# Altium schematic sheet lorabreakout.SchDoc
size A3
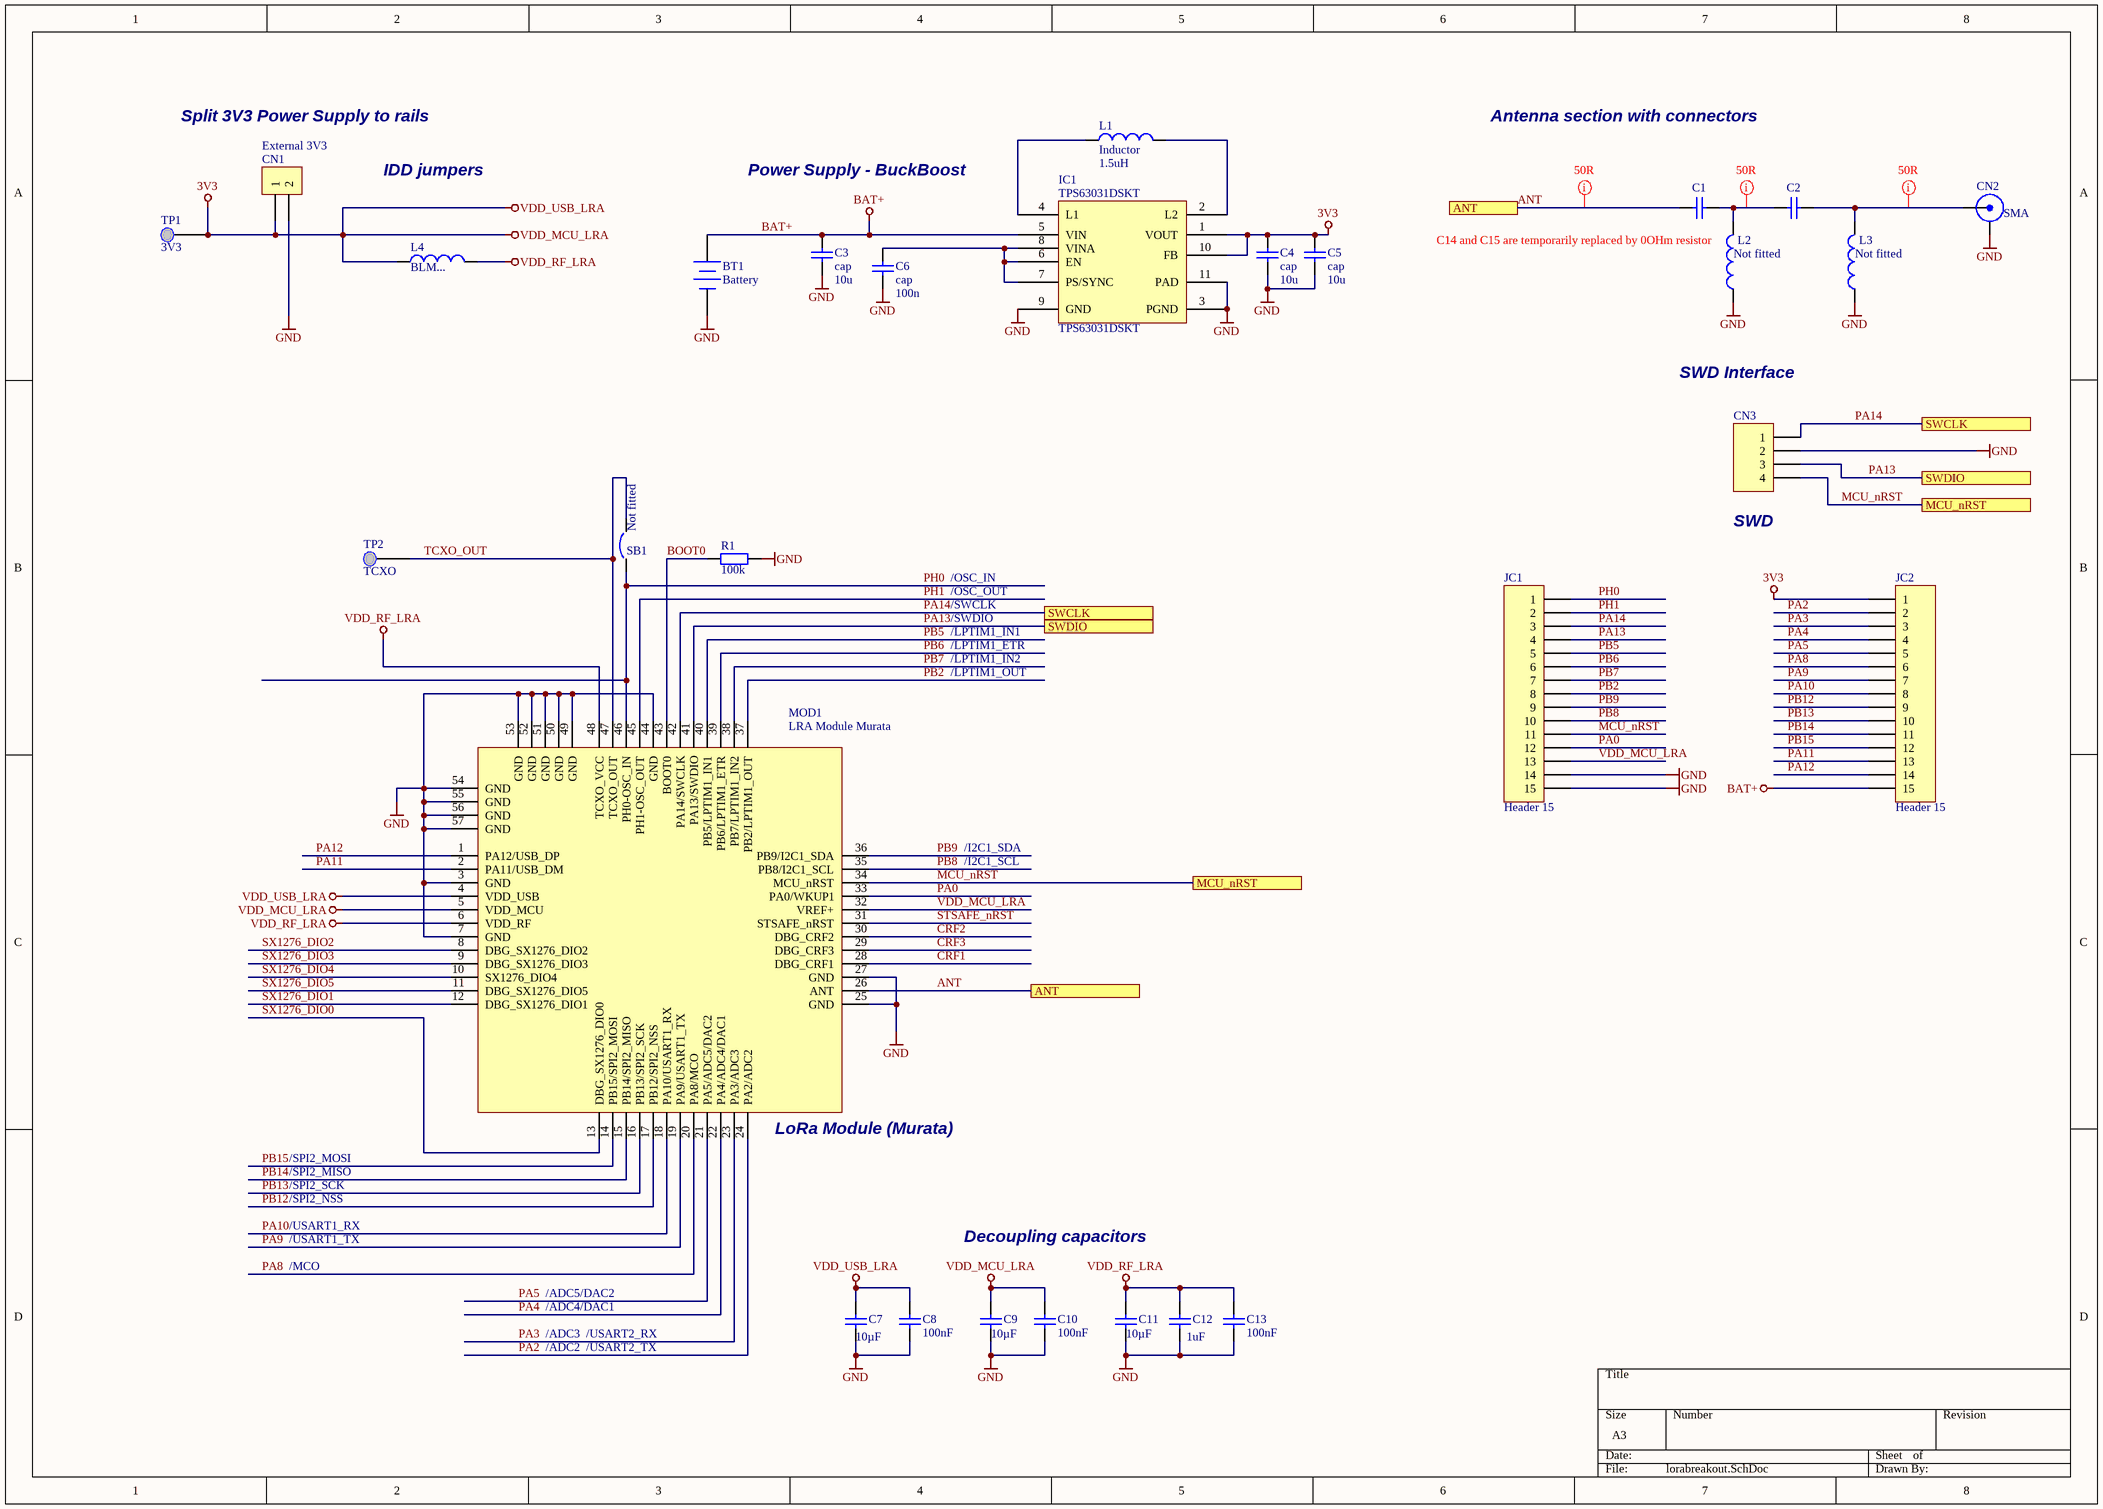
[diagram p0: lorabreakout.SchDoc]

## Parts
BT1  Battery  [SIP2]
C1  (no value)  [0402]
C2  (no value)  [0402]
C3  cap  value 10u  [0603ok]
C4  cap  value 10u  [0603ok]
C5  cap  value 10u  [0603ok]
C6  cap  value 100n  [0603ok]
C7  10µF  [0603C]
C8  100nF  [0603C]
C9  10µF  [0603C]
C10  100nF  [0603C]
C11  10µF  [0603C]
C12  1uF  [0603C]
C13  100nF  [0603C]
CN1  External 3V3  [SIP2]
CN2  SMA  [SMA_COMBO_B]
CN3  Header 4  [SIP4]  (value not drawn)
IC1  TPS63031DSKT  [QFN50P250X250X80_HS-11N]
JC1  Header 15  [HDR1X15]
JC2  Header 15  [HDR1X15]
L1  Inductor  value 1.5uH  [lps3015]
L2  (no value)  [0402]
L3  (no value)  [0402]
L4  BLM...  [0603ok]
MOD1  LRA Module Murata  [Lora Module ES0]
R1  value 100k  [0402]  (hidden comment: Res2)
SB1  Circuit Breaker  [JP2_SMD]  (value not drawn)
TP1  3V3  [SMD-MINITP]
TP2  TCXO  [SMD-MINITP]

## Ports
ANT, MCU_nRST, SWCLK, SWDIO

## Nets
BAT+: BT1.1(+) C3.2 IC1.5(VIN) JC2.15
GND: BT1.2(-) C3.1 C4.1 C5.1 C6.1 C7.2 C8.1 C9.2 C10.1 C11.2 C12.1 C13.1 CN1.2 CN2.2(Y) CN3.2 IC1.3(PGND) IC1.9(GND) IC1.11(PAD) JC1.14 JC1.15 L2.1 L3.1 MOD1.3(GND) MOD1.7(GND) MOD1.25(GND) MOD1.27(GND) MOD1.44(GND) MOD1.49(GND) MOD1.50(GND) MOD1.51(GND) MOD1.52(GND) MOD1.53(GND) MOD1.54(GND) MOD1.55(GND) MOD1.56(GND) MOD1.57(GND) R1.1
VDD_MCU_LRA: C4.2 C5.2 C7.1 C8.2 C9.1 C10.2 CN1.1 IC1.1(VOUT) IC1.10(FB) JC1.13 JC2.1 L4.1 MOD1.4(VDD_USB) MOD1.5(VDD_MCU) MOD1.32(VREF+) TP1.1  [also labelled 3V3, VDD_USB_LRA]
VDD_RF_LRA: C11.1 C12.2 C13.2 L4.2 MOD1.6(VDD_RF) MOD1.48(TCXO_VCC)
ANT: C1.1 MOD1.26(ANT) ; port ANT
BOOT0: MOD1.43(BOOT0) R1.2
CRF1: MOD1.28(DBG_CRF1)
CRF2: MOD1.30(DBG_CRF2)
CRF3: MOD1.29(DBG_CRF3)
MCU_nRST: CN3.4 JC1.11 MOD1.34(MCU_nRST) ; port MCU_nRST
PA0: JC1.12 MOD1.33(PA0/WKUP1)
PA2: JC2.2 MOD1.24(PA2/ADC2)
PA3: JC2.3 MOD1.23(PA3/ADC3)
PA4: JC2.4 MOD1.22(PA4/ADC4/DAC1)
PA5: JC2.5 MOD1.21(PA5/ADC5/DAC2)
PA8: JC2.6 MOD1.20(PA8/MCO)
PA9: JC2.7 MOD1.19(PA9/USART1_TX)
PA10: JC2.8 MOD1.18(PA10/USART1_RX)
PA11: JC2.13 MOD1.2(PA11/USB_DM)
PA12: JC2.14 MOD1.1(PA12/USB_DP)
PA13: CN3.3 JC1.4 MOD1.41(PA13/SWDIO) ; port SWDIO
PA14: CN3.1 JC1.3 MOD1.42(PA14/SWCLK) ; port SWCLK
PB2: JC1.8 MOD1.37(PB2/LPTIM1_OUT)
PB5: JC1.5 MOD1.40(PB5/LPTIM1_IN1)
PB6: JC1.6 MOD1.39(PB6/LPTIM1_ETR)
PB7: JC1.7 MOD1.38(PB7/LPTIM1_IN2)
PB8: JC1.10 MOD1.35(PB8/I2C1_SCL)
PB9: JC1.9 MOD1.36(PB9/I2C1_SDA)
PB12: JC2.9 MOD1.17(PB12/SPI2_NSS)
PB13: JC2.10 MOD1.16(PB13/SPI2_SCK)
PB14: JC2.11 MOD1.15(PB14/SPI2_MISO)
PB15: JC2.12 MOD1.14(PB15/SPI2_MOSI)
PH0: JC1.1 MOD1.46(PH0-OSC_IN) SB1.1
PH1: JC1.2 MOD1.45(PH1-OSC_OUT)
STSAFE_nRST: MOD1.31(STSAFE_nRST)
SX1276_DIO0: MOD1.13(DBG_SX1276_DIO0)
SX1276_DIO1: MOD1.12(DBG_SX1276_DIO1)
SX1276_DIO2: MOD1.8(DBG_SX1276_DIO2)
SX1276_DIO3: MOD1.9(DBG_SX1276_DIO3)
SX1276_DIO4: MOD1.10(SX1276_DIO4)
SX1276_DIO5: MOD1.11(DBG_SX1276_DIO5)
TCXO_OUT: MOD1.47(TCXO_OUT) SB1.2 TP2.1
NetC1_2: C1.2 C2.1 L2.2
NetC2_2: C2.2 CN2.1(X) L3.2
NetC6_2: C6.2 IC1.6(EN) IC1.7(PS/SYNC) IC1.8(VINA)
NetIC1_2: IC1.2(L2) L1.2
NetIC1_4: IC1.4(L1) L1.1

## Layout directives
net class 50R; rule Clearance Constraint [Clearance = 6.2mil]: ANT, NetC1_2, NetC2_2

## Notes on the sheet
- Split 3V3 Power Supply to rails
- IDD jumpers
- Power Supply - BuckBoost
- Antenna section with connectors
- (near L2) C14 and C15 are temporarily replaced by 0OHm resistor
- (near L2) Not fitted
- (near L3) Not fitted
- SWD Interface
- (near SB1) Not fitted
- /OSC_IN
- (near CN3) SWD
- /OSC_OUT
- /SWCLK
- /SWDIO
- /LPTIM1_IN1
- /LPTIM1_ETR
- /LPTIM1_IN2
- /LPTIM1_OUT
- /I2C1_SDA
- /I2C1_SCL
- /SPI2_MOSI
- /SPI2_MISO
- /SPI2_SCK
- (near MOD1) LoRa Module (Murata)
- /SPI2_NSS
- /USART1_RX
- /USART1_TX
- Decoupling capacitors
- /MCO
- /ADC5/DAC2
- /ADC4/DAC1
- /ADC3
- /ADC2
- /USART2_TX
- /USART2_RX

## Library data of the parts
BT1 = Battery: Multicell Battery; Published: 24-Mar-1999; LatestRevisionDate: 17-Jul-2002; LatestRevisionNote: Re-released for DXP Platform.; PackageReference: BAT-2; Publisher: Altium Limited; PackageDescription: Battery; 2 Leads
C1 C2 = CAP SMD 0402 NPO 18PF 16V 5%: 0402; Value: 0E; Fitted: Yes 0Ohm resistor; Manufacturer: *; Manufacturer P/N: *; Order code Farnell: *; Order code RS: *; ECCN_US/UE: *; Order Code Digikey: *; Provided by: *
C3-C6 = cap: Capacitor; Published: 8-Jun-2000; LatestRevisionDate: 17-Jul-2002; LatestRevisionNote: Re-released for DXP Platform.; PackageReference: RAD-0.3; Publisher: Altium Limited; PackageDescription: Radial Cap, Thru-Hole; 2 Leads; 0.3 in Pin Spacing
C7 C9 C11 = CAP_C0805C106K8RACTU: Capacitor SMD 0805 10000000pF X7R 10V +/-10%; Manufacturer: Kemet; Order code RS: ...; Tolerance: 10%; Fitted: Yes; Manufacturer P/N: C0805C106K8RACTU; Order code Farnell: 2118132; Value: 10µF; Rated voltage: 10V; Technology: X7R; Temperature Max: +125°C; Temperature Min: -55°C; Order code Digikey: 399-7411-1-ND
C8 C10 = CAP: Capacitor 100nF; Manufacturer: YAGEO; Manufacturer P/N: CC0603KRX7R9BB104; Provided by: Subcon; Revision: July-2002: Re-released for DXP Platform.; Value: 100nF; ECCN_US/UE: *; Fitted: *; Order Code Digikey: *; Order Code Farnell: *; Order Code RS: *
C12 = CAP SMD 0603  X5R 1µF 25V 10%: 0603  X5R 1µF; Manufacturer: YAGEO; Manufacturer P/N: CC0603KRX5R7BB105; Provided by: Subcon; Order code Farnell: 1288202RL; Value: 1µF; ECCN_US/UE: *; Fitted: *; Order Code Digikey: *
C13 = CAP: Capacitor 100nF; Manufacturer: YAGEO; Manufacturer P/N: CC0603KRX7R9BB104; Fitted: No; Provided by: Subcon; Revision: July-2002: Re-released for DXP Platform.; Value: 100nF; ECCN_US/UE: *; Order Code Digikey: *; Order Code Farnell: *; Order Code RS: *
CN1 = Header 2: Manufacturer: Kontek; Manufacturer P/N: 4710334140400; Order Code RS: 423-2835; Provided by: Subcon; Order Code Farnell: *; ECCN_US/UE: *; Fitted: *; Order Code Digikey: *; Value: *
CN3 = Header 4: Header, 4-Pin, Single row; Manufacturer: Lyconn; Manufacturer P/N: 313140S111116; Provided by: Subcon; Revision: 17-Jul-2002: Re-released for DXP Platform.; ECCN_US/UE: *; Fitted: *; Order Code Digikey: *; Order Code Farnell: *; Order Code RS: *; Value: *
JC1 JC2 = Header 15: Header, 15-Pin; LatestRevisionDate: 17-Jul-2002; LatestRevisionNote: Re-released for DXP Platform.; Publisher: Altium Limited
L1 = Inductor: Code_IEC: 1005; Published: 8-Jun-2000; LatestRevisionDate: 29-May-2009; LatestRevisionNote: IPC-7351 Footprint Added.; PackageReference: 0402-A; Publisher: Altium Limited; PackageDescription: Chip Inductor; Code_JEITA: 0402
L2 L3 = BLM15HG102SN1D: Fitted: No; Manufacturer: *; Manufacturer P/N: *; Order Code Mouser: *; ECCN_US/UE: *; Order Code Digikey: *; Order Code Farnell: *; Order Code RS: *; Provided by: *; Value: *
L4 = BLM15HG102SN1D: Manufacturer: Murata Electronics; Manufacturer P/N: BLM15HG102SN1D; Order Code Mouser: 81-BLM15HG102SN1D; ECCN_US/UE: *; Fitted: *; Order Code Digikey: *; Order Code Farnell: *; Order Code RS: *; Provided by: *; Value: *
MOD1 = LRA Module ES0: Manufacturer: Murata; Manufacturer P/N: LoRa Module ES0; ECCN_US/UE: *; Fitted: *; Order Code Digikey: *; Order Code Farnell: *; Order Code RS: *; Provided by: Murata; Value: *
R1 = Res2: 2k2; Published: 8-Jun-2000; LatestRevisionDate: 17-Jul-2002; LatestRevisionNote: Re-released for DXP Platform.; PackageReference: AXIAL-0.4; Publisher: Altium Limited
SB1 = Circuit Breaker: Fitted: No; Revision: July-2002: Re-released for DXP Platform.; ECCN_US/UE: *; Manufacturer: *; Manufacturer P/N: *; Order Code Digikey: *; Order Code Farnell: *; Order Code RS: *; Provided by: *; Value: *
TP1 TP2 = Testpoint